# Altium project ADCS C2Sv1_2026-05-10T05_36_22_UTC.PrjPcb
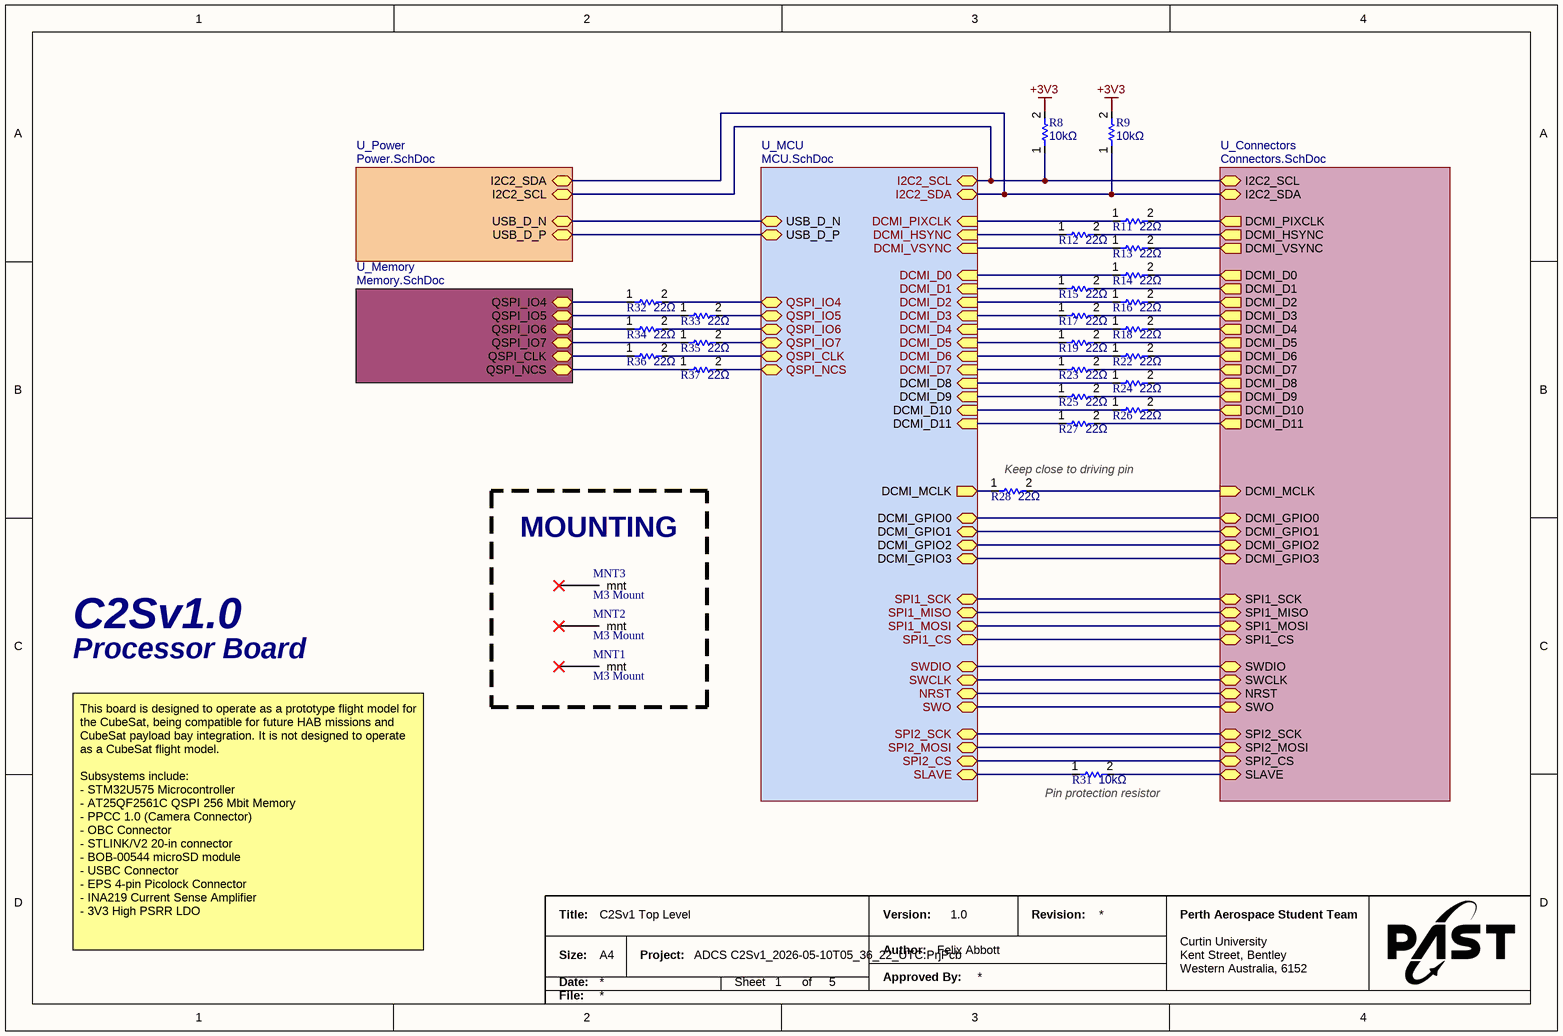
[diagram p0: TopLevel.SchDoc]
Author: Felix Abbott; Version: 1.0
5 sheets, 81 parts. Net scope: hierarchical (ports join the sheet entries above them; power ports are global).
Board file: C2Sv1.PcbDoc
Sheets:
  TopLevel.SchDoc
    U_Connectors = Connectors.SchDoc
    U_Memory = Memory.SchDoc
    U_Power = Power.SchDoc
    U_MCU = MCU.SchDoc

## Sheet TopLevel.SchDoc: C2Sv1 Top Level
size A4; Author: Felix Abbott; SheetNumber: 1; SheetTotal: 5; Time: CubeSat Camera System

### Parts
MNT1  M3 Mount  [M3_Mount-Footprint-1]
MNT2  M3 Mount  [M3_Mount-Footprint-1]
MNT3  M3 Mount  [M3_Mount-Footprint-1]
R8  value 10kΩ  [FP-CRCW0603-e3-IPC_C]  (hidden comment: CRCW060310K0FKED)
R9  value 10kΩ  [FP-CRCW0603-e3-IPC_C]  (hidden comment: CRCW060310K0FKED)
R11  value 22Ω  [FP-CRCW0402-e3-IPC_A]  (hidden comment: CRCW040222R0JNED)
R12  value 22Ω  [FP-CRCW0402-e3-IPC_A]  (hidden comment: CRCW040222R0JNED)
R13  value 22Ω  [FP-CRCW0402-e3-IPC_A]  (hidden comment: CRCW040222R0JNED)
R14  value 22Ω  [FP-CRCW0402-e3-IPC_A]  (hidden comment: CRCW040222R0JNED)
R15  value 22Ω  [FP-CRCW0402-e3-IPC_A]  (hidden comment: CRCW040222R0JNED)
R16  value 22Ω  [FP-CRCW0402-e3-IPC_A]  (hidden comment: CRCW040222R0JNED)
R17  value 22Ω  [FP-CRCW0402-e3-IPC_A]  (hidden comment: CRCW040222R0JNED)
R18  value 22Ω  [FP-CRCW0402-e3-IPC_A]  (hidden comment: CRCW040222R0JNED)
R19  value 22Ω  [FP-CRCW0402-e3-IPC_A]  (hidden comment: CRCW040222R0JNED)
R22  value 22Ω  [FP-CRCW0402-e3-IPC_A]  (hidden comment: CRCW040222R0JNED)
R23  value 22Ω  [FP-CRCW0402-e3-IPC_A]  (hidden comment: CRCW040222R0JNED)
R24  value 22Ω  [FP-CRCW0402-e3-IPC_A]  (hidden comment: CRCW040222R0JNED)
R25  value 22Ω  [FP-CRCW0402-e3-IPC_A]  (hidden comment: CRCW040222R0JNED)
R26  value 22Ω  [FP-CRCW0402-e3-IPC_A]  (hidden comment: CRCW040222R0JNED)
R27  value 22Ω  [FP-CRCW0402-e3-IPC_A]  (hidden comment: CRCW040222R0JNED)
R28  value 22Ω  [FP-CRCW0402-e3-IPC_A]  (hidden comment: CRCW040222R0JNED)
R31  value 10kΩ  [FP-CRCW0603-e3-IPC_C]  (hidden comment: CRCW060310K0FKED)
R32  value 22Ω  [FP-CRCW0402-e3-IPC_A]  (hidden comment: CRCW040222R0JNED)
R33  value 22Ω  [FP-CRCW0402-e3-IPC_A]  (hidden comment: CRCW040222R0JNED)
R34  value 22Ω  [FP-CRCW0402-e3-IPC_A]  (hidden comment: CRCW040222R0JNED)
R35  value 22Ω  [FP-CRCW0402-e3-IPC_A]  (hidden comment: CRCW040222R0JNED)
R36  value 22Ω  [FP-CRCW0402-e3-IPC_A]  (hidden comment: CRCW040222R0JNED)
R37  value 22Ω  [FP-CRCW0402-e3-IPC_A]  (hidden comment: CRCW040222R0JNED)

### Blocks framed on the sheet
MOUNTING: MNT1-MNT3

### Sub-sheets
U_Connectors = Connectors.SchDoc: DCMI_D7 (out), DCMI_D6 (out), DCMI_D5 (out), DCMI_D4 (out), DCMI_D3 (out), DCMI_D2 (out), DCMI_D0 (out), DCMI_D1 (out), DCMI_PIXCLK (out), DCMI_HSYNC (out), DCMI_VSYNC (out), DCMI_D8 (out), DCMI_D9 (out), DCMI_D10 (out), DCMI_D11 (out), DCMI_MCLK (in), DCMI_GPIO0 (bidir), DCMI_GPIO1 (bidir), DCMI_GPIO2 (bidir), DCMI_GPIO3 (bidir), SPI1_SCK (bidir), SPI1_MISO (bidir), SPI1_MOSI (bidir), SPI1_CS (bidir), SWDIO (bidir), SWCLK (bidir), NRST (bidir), SWO (bidir), SPI2_SCK (bidir), SPI2_MOSI (bidir), SPI2_CS (bidir), SLAVE (bidir), I2C2_SCL (bidir), I2C2_SDA (bidir)
U_MCU = MCU.SchDoc: DCMI_PIXCLK (in), DCMI_VSYNC (in), DCMI_HSYNC (in), DCMI_D7 (in), DCMI_D6 (in), DCMI_D5 (in), DCMI_D4 (in), DCMI_D3 (in), DCMI_D2 (in), DCMI_D1 (in), DCMI_D0 (in), DCMI_D8 (in), DCMI_D9 (in), DCMI_D11 (in), DCMI_D10 (in), DCMI_MCLK (out), DCMI_GPIO0 (bidir), DCMI_GPIO2 (bidir), DCMI_GPIO1 (bidir), DCMI_GPIO3 (bidir), NRST (bidir), SWO (bidir), SWCLK (bidir), SWDIO (bidir), SPI1_MOSI (bidir), SPI1_MISO (bidir), SPI1_CS (bidir), SLAVE (bidir), SPI1_SCK (bidir), SPI2_SCK (bidir), SPI2_CS (bidir), SPI2_MOSI (bidir), I2C2_SCL (bidir), I2C2_SDA (bidir), QSPI_IO7 (bidir), QSPI_IO6 (bidir), QSPI_IO5 (bidir), QSPI_IO4 (bidir), QSPI_CLK (bidir), QSPI_NCS (bidir), USB_D_N (bidir), USB_D_P (bidir)
U_Memory = Memory.SchDoc: QSPI_IO4 (bidir), QSPI_IO5 (bidir), QSPI_IO6 (bidir), QSPI_IO7 (bidir), QSPI_CLK (bidir), QSPI_NCS (bidir)
U_Power = Power.SchDoc: USB_D_N (bidir), USB_D_P (bidir), I2C2_SDA (bidir), I2C2_SCL (bidir)

### Nets
+3V3: R8.2 R9.2
DCMI_D0: R14.1 ; sheet U_MCU/DCMI_D0
DCMI_D1: R15.1 ; sheet U_MCU/DCMI_D1
DCMI_D2: R16.1 ; sheet U_MCU/DCMI_D2
DCMI_D3: R17.1 ; sheet U_MCU/DCMI_D3
DCMI_D4: R18.1 ; sheet U_MCU/DCMI_D4
DCMI_D5: R19.1 ; sheet U_MCU/DCMI_D5
DCMI_D6: R22.1 ; sheet U_MCU/DCMI_D6
DCMI_D7: R23.1 ; sheet U_MCU/DCMI_D7
DCMI_D8: R24.1 ; sheet U_MCU/DCMI_D8
DCMI_D9: R25.1 ; sheet U_MCU/DCMI_D9
DCMI_D10: R26.1 ; sheet U_MCU/DCMI_D10
DCMI_D11: R27.1 ; sheet U_MCU/DCMI_D11
DCMI_GPIO0: sheet U_Connectors/DCMI_GPIO0, sheet U_MCU/DCMI_GPIO0
DCMI_GPIO1: sheet U_Connectors/DCMI_GPIO1, sheet U_MCU/DCMI_GPIO1
DCMI_GPIO2: sheet U_Connectors/DCMI_GPIO2, sheet U_MCU/DCMI_GPIO2
DCMI_GPIO3: sheet U_Connectors/DCMI_GPIO3, sheet U_MCU/DCMI_GPIO3
DCMI_HSYNC: R12.1 ; sheet U_MCU/DCMI_HSYNC
DCMI_MCLK: R28.1 ; sheet U_MCU/DCMI_MCLK
DCMI_PIXCLK: R11.1 ; sheet U_MCU/DCMI_PIXCLK
DCMI_VSYNC: R13.1 ; sheet U_MCU/DCMI_VSYNC
I2C2_SCL: R8.1 ; sheet U_Connectors/I2C2_SCL, sheet U_Power/I2C2_SCL, sheet U_MCU/I2C2_SCL
I2C2_SDA: R9.1 ; sheet U_Connectors/I2C2_SDA, sheet U_Power/I2C2_SDA, sheet U_MCU/I2C2_SDA
NRST: sheet U_Connectors/NRST, sheet U_MCU/NRST
QSPI_CLK: R36.2 ; sheet U_MCU/QSPI_CLK
QSPI_IO4: R32.2 ; sheet U_MCU/QSPI_IO4
QSPI_IO5: R33.2 ; sheet U_MCU/QSPI_IO5
QSPI_IO6: R34.2 ; sheet U_MCU/QSPI_IO6
QSPI_IO7: R35.2 ; sheet U_MCU/QSPI_IO7
QSPI_NCS: R37.2 ; sheet U_MCU/QSPI_NCS
SLAVE: R31.1 ; sheet U_MCU/SLAVE
SPI1_CS: sheet U_Connectors/SPI1_CS, sheet U_MCU/SPI1_CS
SPI1_MISO: sheet U_Connectors/SPI1_MISO, sheet U_MCU/SPI1_MISO
SPI1_MOSI: sheet U_Connectors/SPI1_MOSI, sheet U_MCU/SPI1_MOSI
SPI1_SCK: sheet U_Connectors/SPI1_SCK, sheet U_MCU/SPI1_SCK
SPI2_CS: sheet U_Connectors/SPI2_CS, sheet U_MCU/SPI2_CS
SPI2_MOSI: sheet U_Connectors/SPI2_MOSI, sheet U_MCU/SPI2_MOSI
SPI2_SCK: sheet U_Connectors/SPI2_SCK, sheet U_MCU/SPI2_SCK
SWCLK: sheet U_Connectors/SWCLK, sheet U_MCU/SWCLK
SWDIO: sheet U_Connectors/SWDIO, sheet U_MCU/SWDIO
SWO: sheet U_Connectors/SWO, sheet U_MCU/SWO
USB_D_N: sheet U_Power/USB_D_N, sheet U_MCU/USB_D_N
USB_D_P: sheet U_Power/USB_D_P, sheet U_MCU/USB_D_P
NetJ5_4: R12.2 ; sheet U_Connectors/DCMI_HSYNC
NetJ5_5: R13.2 ; sheet U_Connectors/DCMI_VSYNC
NetJ5_6: R11.2 ; sheet U_Connectors/DCMI_PIXCLK
NetJ5_8: R28.2 ; sheet U_Connectors/DCMI_MCLK
NetJ5_10: R27.2 ; sheet U_Connectors/DCMI_D11
NetJ5_11: R26.2 ; sheet U_Connectors/DCMI_D10
NetJ5_12: R25.2 ; sheet U_Connectors/DCMI_D9
NetJ5_13: R24.2 ; sheet U_Connectors/DCMI_D8
NetJ5_14: R23.2 ; sheet U_Connectors/DCMI_D7
NetJ5_15: R22.2 ; sheet U_Connectors/DCMI_D6
NetJ5_16: R19.2 ; sheet U_Connectors/DCMI_D5
NetJ5_17: R18.2 ; sheet U_Connectors/DCMI_D4
NetJ5_18: R17.2 ; sheet U_Connectors/DCMI_D3
NetJ5_19: R16.2 ; sheet U_Connectors/DCMI_D2
NetJ5_20: R15.2 ; sheet U_Connectors/DCMI_D1
NetJ5_21: R14.2 ; sheet U_Connectors/DCMI_D0
NetP3_2: R31.2 ; sheet U_Connectors/SLAVE
NetQSPI_1: R37.1 ; sheet U_Memory/QSPI_NCS
NetQSPI_2: R33.1 ; sheet U_Memory/QSPI_IO5
NetQSPI_3: R34.1 ; sheet U_Memory/QSPI_IO6
NetQSPI_5: R32.1 ; sheet U_Memory/QSPI_IO4
NetQSPI_6: R36.1 ; sheet U_Memory/QSPI_CLK
NetQSPI_7: R35.1 ; sheet U_Memory/QSPI_IO7

Not connected (* = marked no-connect by the designer): MNT1 1(mnt)*; MNT2 1(mnt)*; MNT3 1(mnt)*

### Notes on the sheet
- (near R28) Keep close to driving pin
- C2Sv1.0
- Processor Board
- (near R31) Pin protection resistor
- This board is designed to operate as a prototype flight model for the CubeSat, being compatible for future HAB missions and CubeSat payload bay integration. It is not designed to operate as a CubeSat flight model.
  Subsystems include:
  - STM32U575 Microcontroller
  - AT25QF2561C QSPI 256 Mbit Memory
  - PPCC 1.0 (Camera Connector)
  - OBC Connector
  - STLINK/V2 20-in connector
  - BOB-00544 microSD module
  - USBC Connector
  - EPS 4-pin Picolock Connector
  - INA219 Current Sense Amplifier
  - 3V3 High PSRR LDO
- Title:
- Version:
- Revision:
- Perth Aerospace Student Team
- Size:
- Date:
- A4
- Project:
- Sheet
- of
- Author:
- Approved By:
- Curtin University
- Kent Street, Bentley
- Western Australia, 6152
- File:

### Library data of the parts
MNT1-MNT3 = CMP-002-00124-2: M3 mounting hole; Author: Raphael Ho
R8 R9 R31 = CMP-009-00205-3: Resistor; Temperature Coefficient: 100ppm/°C; Working Voltage: 75V; Power Dissipation: 100mW; Added By: Felix; Tolerance: 1%; Max Operating Temperature: 155°C; Width: 850µm; Composition: Thick Film; Mounting Technology: Surface Mount; Number of Terminations: 2; Height: 450µm; Number of Terminals: 2; RoHS: Compliant; Power Rating: 100mW; Harmonized Tariff Schedule (HTS) Code: 8533.21.00.30; Case/Package: 0603; Export Control Classification Number (ECCN) Code: EAR99; Introduction Date: 2003-05-01; REACH SVHC: Yes; Lead Free: Lead Free; Features: Automotive AEC-Q200; Min Operating Temperature: -55°C; Voltage Rating: 75V; Country of Origin: Israel, Taiwan; Lifecycle Status: Production; Max Power Dissipation: 100mW; Length: 1.55mm; Packaging: Tape & Reel (TR); China RoHS: Non-Compliant
R11-R19 R22-R28 R32-R37 = CMP-009-00208-3: Resistor; Max Power Dissipation: 63mW; Tolerance: 5%; Added By: Felix Abbott; Working Voltage: 50V; Temperature Coefficient: 200ppm/°C; Lifecycle Status: Production; Case/Package: 0402; RoHS: Compliant; Features: Automotive AEC-Q200; Width: 500µm; REACH SVHC: Yes; Schedule B: 8533210045, 8533210045; Lead Free: Lead Free; Min Operating Temperature: -55°C; Pins: 2; Number of Terminations: 2; Export Control Classification Number (ECCN) Code: EAR99; Introduction Date: 2005-03-24; Ratings: AEC-Q200; Length: 1mm; Military Standard: Not; Power Rating: 63mW; Weight: 652.039032µg; Height: 350µm; Mounting Technology: Surface Mount; Termination: SMD/SMT; Composition: Thick Film; China RoHS: Non-Compliant; Max Operating Temperature: 155°C; Depth: 500µm; Country of Origin: Israel, Taiwan; Voltage Rating (DC): 50V; Packaging: Cut Tape; Contact Plating: Tin; Case Code (Imperial): 0402; Voltage Rating: 50V; Number of Terminals: 2; Harmonized Tariff Schedule (HTS) Code: 8533.21.00.30

## Sheet Connectors.SchDoc: C2S Connectors
size A4; SheetNumber: 5; SheetTotal: 5
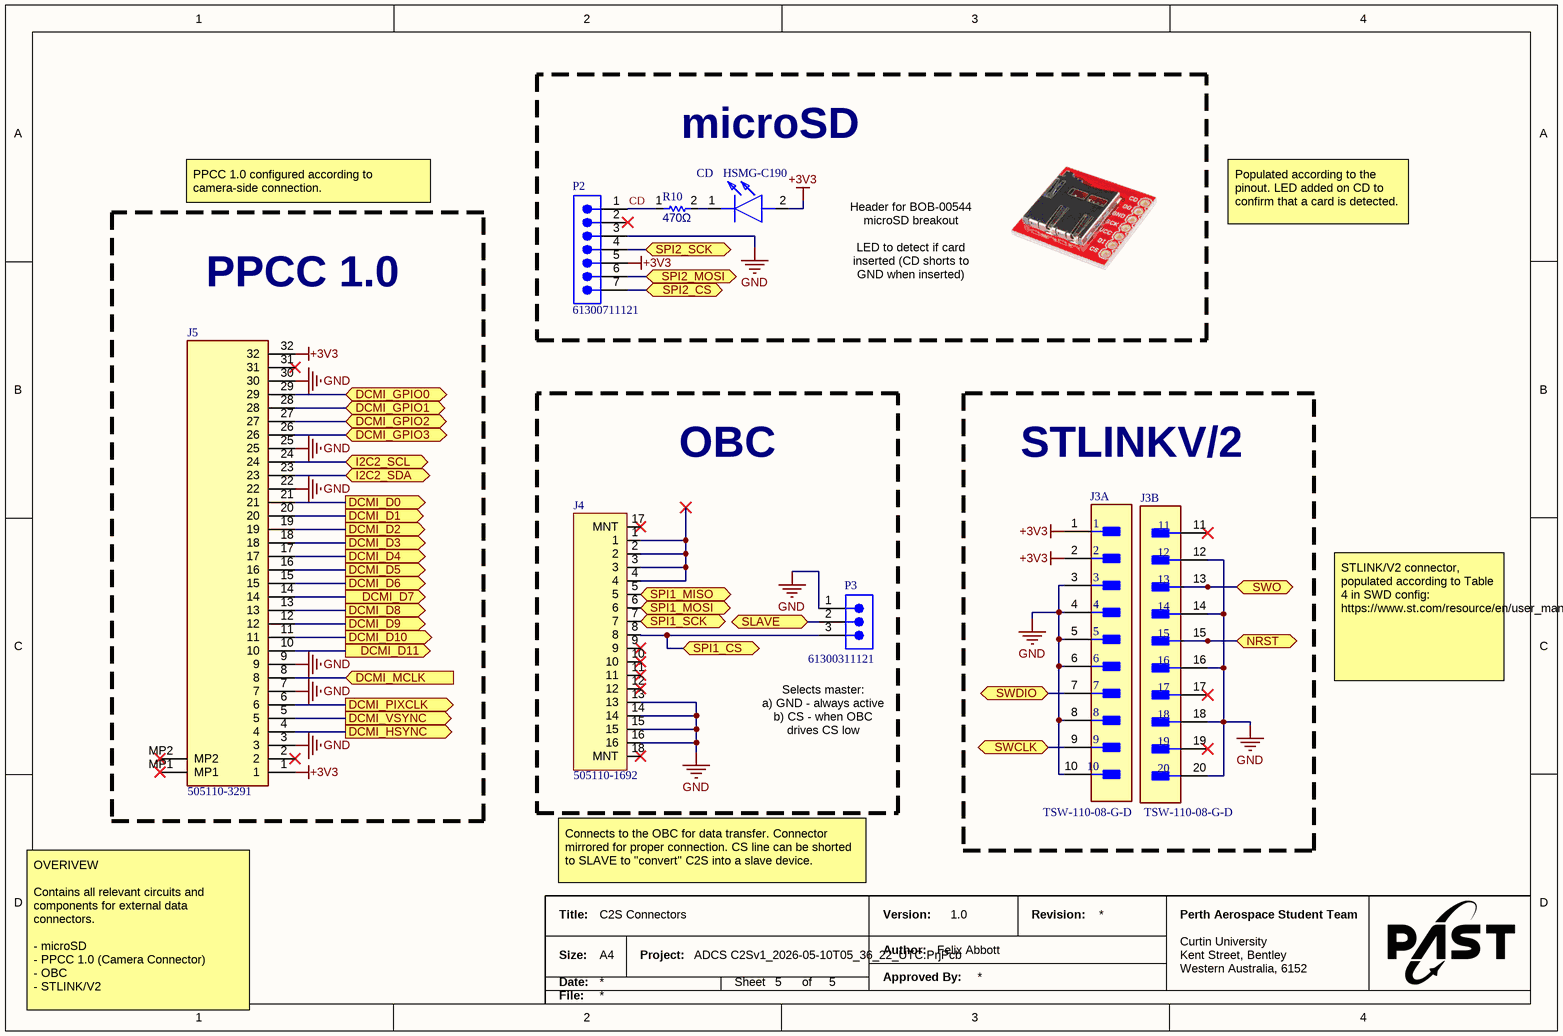
[diagram p1: Connectors.SchDoc]

### Parts
CD  HSMG-C190  [LEDC1608X90N]
J3  TSW-110-08-G-D  [FP-TSW-110-08-G-D-MFG]  (parts A,B of 2)
J4  505110-1692  [FP-505110-1692-MFG]
J5  505110-3291  [5051103291]
P2  61300711121  [61300711121]
P3  61300311121  [61300311121]
R10  value 470Ω  [FP-CRCW0603-e3-IPC_C]  (hidden comment: CRCW0603470RFKEC)

### Blocks framed on the sheet
microSD: CD P2 R10
PPCC 1.0: J5
OBC: J4 P3
STLINKV/2: J3

### Ports
DCMI_D0 (out), DCMI_D1 (out), DCMI_D2 (out), DCMI_D3 (out), DCMI_D4 (out), DCMI_D5 (out), DCMI_D6 (out), DCMI_D7 (out), DCMI_D8 (out), DCMI_D9 (out), DCMI_D10 (out), DCMI_D11 (out), DCMI_GPIO0 (bidir), DCMI_GPIO1 (bidir), DCMI_GPIO2 (bidir), DCMI_GPIO3 (bidir), DCMI_HSYNC (out), DCMI_MCLK (in), DCMI_PIXCLK (out), DCMI_VSYNC (out), I2C2_SCL (bidir), I2C2_SDA (bidir), NRST (bidir), SLAVE (bidir), SPI1_CS (bidir), SPI1_MISO (bidir), SPI1_MOSI (bidir), SPI1_SCK (bidir), SPI2_CS (bidir), SPI2_MOSI (bidir), SPI2_SCK (bidir), SWCLK (bidir), SWDIO (bidir), SWO (bidir)

### Nets
+3V3: CD.2(A) J3.1 J3.2 J5.1 J5.32 P2.5
GND: J3.3 J3.4 J3.5 J3.6 J3.8 J3.10 J3.12 J3.14 J3.16 J3.18 J3.20 J4.13 J4.14 J4.15 J4.16 J5.3 J5.7 J5.9 J5.22 J5.25 J5.30 P2.3 P3.1
CD: P2.1 R10.1
DCMI_GPIO0: J5.29 ; port DCMI_GPIO0
DCMI_GPIO1: J5.28 ; port DCMI_GPIO1
DCMI_GPIO2: J5.27 ; port DCMI_GPIO2
DCMI_GPIO3: J5.26 ; port DCMI_GPIO3
I2C2_SCL: J5.24 ; port I2C2_SCL
I2C2_SDA: J5.23 ; port I2C2_SDA
NRST: J3.15 ; port NRST
SPI1_CS: J4.8 P3.3 ; port SPI1_CS
SPI1_MISO: J4.5 ; port SPI1_MISO
SPI1_MOSI: J4.6 ; port SPI1_MOSI
SPI1_SCK: J4.7 ; port SPI1_SCK
SPI2_CS: P2.7 ; port SPI2_CS
SPI2_MOSI: P2.6 ; port SPI2_MOSI
SPI2_SCK: P2.4 ; port SPI2_SCK
SWCLK: J3.9 ; port SWCLK
SWDIO: J3.7 ; port SWDIO
SWO: J3.13 ; port SWO
NetCD_1: CD.1(K) R10.2
NetJ4_1: J4.1 J4.2 J4.3 J4.4
NetJ5_4: J5.4 ; port DCMI_HSYNC
NetJ5_5: J5.5 ; port DCMI_VSYNC
NetJ5_6: J5.6 ; port DCMI_PIXCLK
NetJ5_8: J5.8 ; port DCMI_MCLK
NetJ5_10: J5.10 ; port DCMI_D11
NetJ5_11: J5.11 ; port DCMI_D10
NetJ5_12: J5.12 ; port DCMI_D9
NetJ5_13: J5.13 ; port DCMI_D8
NetJ5_14: J5.14 ; port DCMI_D7
NetJ5_15: J5.15 ; port DCMI_D6
NetJ5_16: J5.16 ; port DCMI_D5
NetJ5_17: J5.17 ; port DCMI_D4
NetJ5_18: J5.18 ; port DCMI_D3
NetJ5_19: J5.19 ; port DCMI_D2
NetJ5_20: J5.20 ; port DCMI_D1
NetJ5_21: J5.21 ; port DCMI_D0
NetP3_2: P3.2 ; port SLAVE

Not connected (* = marked no-connect by the designer): J3 11* 17* 19*; J4 9* 10* 11* 12* 17(MNT)* 18(MNT)*; J5 2* 31* MP1* MP2*; P2 2*

### Notes on the sheet
- PPCC 1.0 configured according to camera-side connection.
- Populated according to the pinout. LED added on CD to confirm that a card is detected.
- Header for BOB-00544 microSD breakout
  LED to detect if card inserted (CD shorts to GND when inserted)
- STLINK/V2 connector, populated according to Table 4 in SWD config: https://www.st.com/resource/en/user_manual/um1075-stlinkv2-incircuit-debuggerprogrammer-for-stm8-and-stm32-stmicroelectronics.pdf
- (near P3) Selects master:
  a) GND - always active
  b) CS - when OBC drives CS low
- Connects to the OBC for data transfer. Connector mirrored for proper connection. CS line can be shorted to SLAVE to "convert" C2S into a slave device.
- OVERIVEW
  Contains all relevant circuits and components for external data connectors.
  - microSD
  - PPCC 1.0 (Camera Connector)
  - OBC
  - STLINK/V2
- Title:
- Version:
- Revision:
- Perth Aerospace Student Team
- Size:
- Date:
- A4
- Project:
- Sheet
- of
- Author:
- Approved By:
- Curtin University
- Kent Street, Bentley
- Western Australia, 6152
- File:

### Library data of the parts
CD = CMP-062-000014-1: LED; Manufacturer_Name: Avago Technologies; Mouser Part Number: 630-HSMG-C190; Manufacturer_Part_Number: HSMG-C190; Mouser Price/Stock: https://www.mouser.co.uk/ProductDetail/Broadcom-Avago/HSMG-C190?qs=YDL0qNrpDT605sxOaps8VQ%3D%3D; Datasheet Link: https://docs.broadcom.com/docs/AV02-0551EN; Source: SamacSys.SchLib; Design Item ID: HSMG-C190; Height: 0.9mm
J3 = CMP-02766-000083-1: CONN HEADER VERT 20POS 2.54MM; Manufacturer: Samtec; Conn Gender: Male; Number Of Contacts: 20; Conn Orientation: Straight; Lead Free: Yes; Category: Conn; Manufacturer Part Number: TSW-110-08-G-D; Temperature Range High: +125°C; Pitch: 2.54mm; Temperature: -55°C to +125°C; Automotive: No; Device Class L1: Connectors; ComponentLink2URL: http://suddendocs.samtec.com/prints/tsw-xxx-xx-xxx-x-xx-xxx-mkt.pdf; Temperature Range Low: -55°C; ComponentLink2Description: Datasheet; Height: 8.71mm; Number Of Rows: 2; Digikey Description: CONN HEADER VERT 20POS 2.54MM; Package: TSW-110-08-G-D; Device Class L3: unset; Contact Material: Gold,Nickel; Octopart: https://octopart.com/tsw-110-08-g-d-samtec-272555; Footprint Url: http://suddendocs.samtec.com/prints/tsw-xxx-xx-x-x-xx-xxx-footprint.pdf; RoHS: TRUE; Ipc Land Pattern Name: CAPAD1016W80L630D240; Device Class L2: Headers and Wire Housings
J4 = CMP-002-00119-1: Conn FFC/FPC Connector SKT 16 POS 0.5mm Solder RA SMD Easy-On™ T/R
J5 = CMP-220-000001-1: Easy-On FFC/FPC Connector; Manufacturer_Name: Molex; Added By: Felix Abbott; Mouser Part Number: 538-505110-3291; Height: 4.06mm; Source: Schlib1.SchLib; Manufacturer_Part_Number: 505110-3291; Mouser Price/Stock: https://www.mouser.co.uk/ProductDetail/Molex/505110-3291?qs=0lSvoLzn4L9xGyl4KYdheA%3D%3D; Design Item ID: 505110-3291; Datasheet Link: https://www.molex.com/pdm_docs/sd/5051103291_sd.pdf
P2 = CMP-096-000168-1: WR-PHD Pin Header, THT, Vertical, pitch 2.54mm, 1 Row, 7P; Manufacturer: Wurth Elektronik; Rated Current: 3A; Withstanding Voltage: 500V; Working Voltage: 250V; Contact Resistance: 20mOhm; Match Code: WR-PHD; Orientation: Vertical; Component Type: Standard; Source: WR-PHD.SchLib; ComponentLink1URL: https://www.we-online.com/redexpert/article/61300711121?ad; Mount: Through Hole; Category: Board-to-Board Connectors; Packaging: Bag; Operating Temperature Max: 105°C; Number of Pins: 7; Design Item ID: 61300711121; Operating Temperature Min: -40°C; Pin Count: 7; Pitch: 2.54mm; Number of Rows: 1; Gender: Pin Header; Manufacturer Part Number: 61300711121; ComponentLink1Description: Website Link; ComponentLink2URL: https://www.we-online.com/redexpert/spec/61300711121?ad; ComponentLink2Description: Datasheet Link
P3 = CMP-096-000137-1: WR-PHD Pin Header, THT, Vertical, pitch 2.54mm, 1 Row, 3P; Manufacturer: Wurth Elektronik; Contact Resistance: 20mOhm; Rated Current: 3A; Withstanding Voltage: 500V; Working Voltage: 250V; Operating Temperature Max: 105°C; Manufacturer Part Number: 61300311121; Match Code: WR-PHD; ComponentLink2Description: Datasheet Link; ComponentLink1Description: Website Link; Number of Pins: 3; Orientation: Vertical; Mount: Through Hole; Gender: Pin Header; Pin Count: 3; ComponentLink2URL: https://www.we-online.com/redexpert/spec/61300311121?ad; Pitch: 2.54mm; Packaging: Bag; Operating Temperature Min: -40°C; ComponentLink1URL: https://www.we-online.com/redexpert/article/61300311121?ad; Component Type: Standard; Design Item ID: 61300311121; Source: WR-PHD.SchLib; Category: Board-to-Board Connectors; Number of Rows: 1
R10 = CMP-009-00206-1: Resistor; Power Dissipation: 100mW; Voltage Rating: 75V; Tolerance: 1%; Added By: Felix; Temperature Coefficient: 100ppm/°C; China RoHS: Non-Compliant; Mounting Technology: Surface Mount; Export Control Classification Number (ECCN) Code: EAR99; Depth: 850µm; Number of Terminals: 2; REACH SVHC: Yes; Case/Package: 0603; Harmonized Tariff Schedule (HTS) Code: 8533.21.00.30; Lifecycle Status: Production; Max Operating Temperature: 155°C; Length: 1.55mm; Lead Free: Lead Free; Max Power Dissipation: 100mW; RoHS: Compliant; Height: 450µm; Min Operating Temperature: -55°C; Width: 850µm; Country of Origin: Israel, Taiwan; Composition: Thick Film; Military Standard: Not; Number of Terminations: 2; Features: Automotive AEC-Q200; Packaging: Tape & Reel (TR); Power Rating: 100mW; Introduction Date: 2005-02-16; Working Voltage: 75V

## Sheet Memory.SchDoc: QSPI
size A4; SheetNumber: 3; SheetTotal: 5; Time: C2S Memory
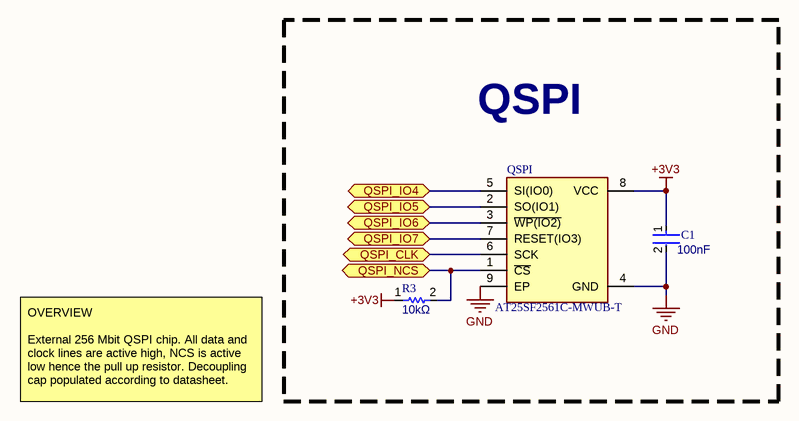
[diagram p2: Memory.SchDoc]

### Parts
C1  value 100nF  [FP-GCM188-0_1-IPC_B]  (hidden comment: GCM188L81H104MA57D)
QSPI  AT25SF2561C-MWUB-T  [SON127P800X600X80-9N-D]
R3  value 10kΩ  [FP-CRCW0603-e3-IPC_C]  (hidden comment: CRCW060310K0FKED)

### Blocks framed on the sheet
QSPI: C1 QSPI R3

### Ports
QSPI_CLK (bidir), QSPI_IO4 (bidir), QSPI_IO5 (bidir), QSPI_IO6 (bidir), QSPI_IO7 (bidir), QSPI_NCS (bidir)

### Nets
+3V3: C1.1 QSPI.8(VCC) R3.1
GND: C1.2 QSPI.4(GND) QSPI.9(EP)
NetQSPI_1: QSPI.1(~{CS}) R3.2 ; port QSPI_NCS
NetQSPI_2: QSPI.2(SO(IO1)) ; port QSPI_IO5
NetQSPI_3: QSPI.3(~{WP(IO2)}) ; port QSPI_IO6
NetQSPI_5: QSPI.5(SI(IO0)) ; port QSPI_IO4
NetQSPI_6: QSPI.6(SCK) ; port QSPI_CLK
NetQSPI_7: QSPI.7(RESET(IO3)) ; port QSPI_IO7

### Notes on the sheet
- OVERVIEW
  External 256 Mbit QSPI chip. All data and clock lines are active high, NCS is active low hence the pull up resistor. Decoupling cap populated according to datasheet.
- Title:
- Version:
- Revision:
- Perth Aerospace Student Team
- Size:
- Date:
- A4
- Project:
- Sheet
- of
- Author:
- Approved By:
- Curtin University
- Kent Street, Bentley
- Western Australia, 6152
- File:

### Library data of the parts
C1 = CMP-001-00108-1: Cap Ceramic 0.1uF 50V X8L 20% Pad SMD 0603 150C Automotive T/R; Manufacturer Lifecycle Status: IN PRODUCTION; Added By: Felix; Country of Origin: Philippines; Number of Terminals: 2; Max Operating Temperature: 150°C; Tolerance: 20%; Harmonized Tariff Schedule (HTS) Code: 8532.24.00.20; Length: 1.6mm; Thickness: 800µm; Export Control Classification Number (ECCN) Code: EAR99; Voltage Rating (DC): 50V; Mounting Technology: Surface Mount; Dielectric Material: Ceramic; Height: 800µm; Lifecycle Status: Production; Material: Ceramic; Introduction Date: 2013-11-20; Voltage Rating: 50V; Width: 800µm; RoHS: Compliant; REACH SVHC: Yes; Min Operating Temperature: -55°C; Case/Package: 0603
QSPI = CMP-181-000004-3: Integrated Circuit; Manufacturer_Name: Renesas Electronics; Imported By: Felix; Source: C2Sv0.1.SchLib; Manufacturer_Part_Number: AT25SF2561C-MWUB-T; Height: 0.8mm; Design Item ID: AT25SF2561C-MWUB-T; Datasheet Link: https://www.renesas.com/us/en/products/memory-logic/non-volatile-memory/spi-nor-flash/at25sf2561c-256mbit-3v-spi-serial-flash-memory-single-dual-quad-io-qpi-and-dtr-support
R3 = CMP-009-00205-3: as R8 on sheet TopLevel; Max Operating Temperature: 155°C; Width: 850µm; Composition: Thick Film; Mounting Technology: Surface Mount; Number of Terminations: 2; Height: 450µm; Number of Terminals: 2; RoHS: Compliant; Power Rating: 100mW; Harmonized Tariff Schedule (HTS) Code: 8533.21.00.30; Case/Package: 0603; Export Control Classification Number (ECCN) Code: EAR99; Introduction Date: 2003-05-01; REACH SVHC: Yes; Lead Free: Lead Free; Features: Automotive AEC-Q200; Min Operating Temperature: -55°C; Voltage Rating: 75V; Country of Origin: Israel, Taiwan; Lifecycle Status: Production; Max Power Dissipation: 100mW; Length: 1.55mm; Packaging: Tape & Reel (TR); China RoHS: Non-Compliant

## Sheet Power.SchDoc: C2Sv1 Power
size A4; SheetNumber: 4; SheetTotal: 5
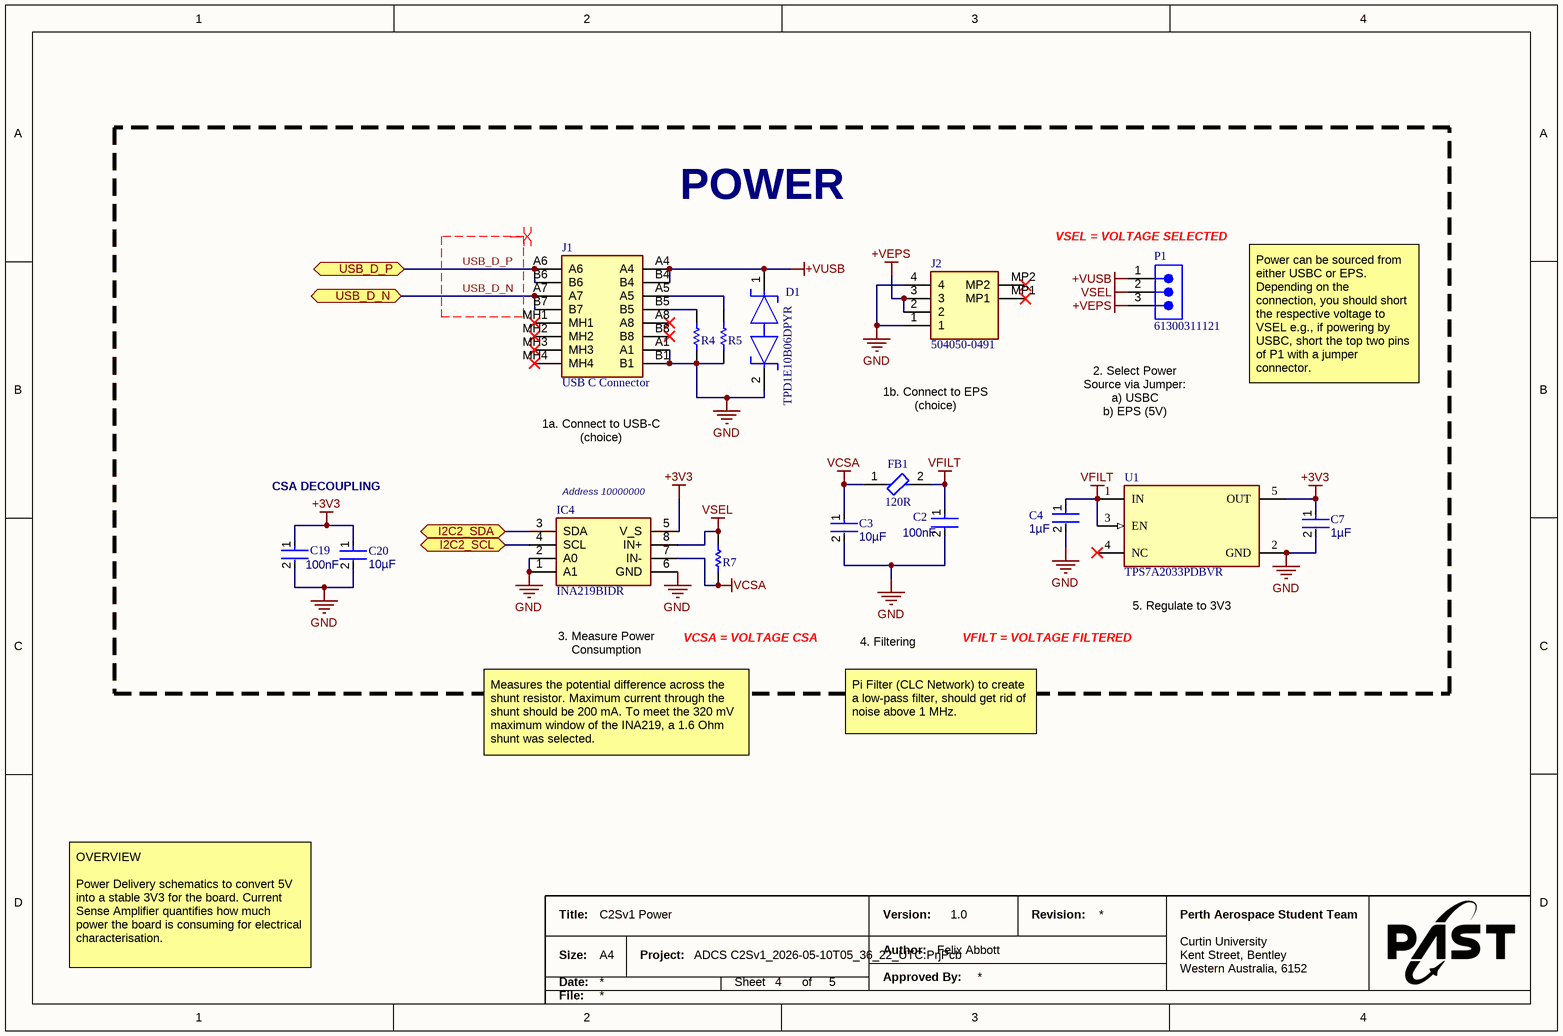
[diagram p3: Power.SchDoc]

### Parts
C2  value 100nF  [FP-GCM188-0_1-IPC_B]  (hidden comment: GCM188L81H104MA57D)
C3  value 10µF  [FP-GCM188-0_2-IPC_B]  (hidden comment: GCM188D70J106ME36D)
C4  value 1µF  [FP-GCM188-0_1-IPC_B]  (hidden comment: GCM188R71C105KA64J)
C7  value 1µF  [FP-GCM188-0_1-IPC_B]  (hidden comment: GCM188R71C105KA64J)
C19  value 100nF  [FP-GCM188-0_1-IPC_B]  (hidden comment: GCM188L81H104MA57D)
C20  value 10µF  [FP-GCM188-0_2-IPC_B]
D1  TPD1E10B06DPYR  [FP-DPY0002A-MFG]
FB1  120R  [FP-BLM18-0_15-t0_6-d1_2-IPC_B]
IC4  INA219BIDR  [SOIC127P600X175-8N]
J1  USB C Connector  [UJ20CHGMSMT2P16TR]
J2  504050-0491  [5040500491]
P1  61300311121  [61300311121]
R4  5.1k  [RESC1608X55N]  (value not drawn)
R5  5.1k  [RESC1608X55N]  (value not drawn)
R7  ERJ-6DQF1R6V  [ERJ6_B_BW_R_LW_CW_D]  (value not drawn)
U1  TPS7A2033PDBVR  [FP-DBV0005A-IPC_B]

### Ports
I2C2_SCL (bidir), I2C2_SDA (bidir), USB_D_N (bidir), USB_D_P (bidir)

### Nets
+3V3: C7.1 C19.1 C20.1 IC4.5(V_S) U1.5(OUT)
+VEPS: J2.2 J2.3 P1.3
+VUSB: D1.1 J1.A4 J1.B4 P1.1
GND: C2.2 C3.2 C4.2 C7.2 C19.2 C20.2 D1.2 IC4.1(A1) IC4.2(A0) IC4.6(GND) J1.A1 J1.B1 J2.1 J2.4 R4.2 R5.2 U1.2(GND)
VCSA: C3.1 FB1.1 IC4.7(IN-) R7.1
VFILT: C2.1 C4.1 FB1.2 U1.1(IN) U1.3(EN)
VSEL: IC4.8(IN+) P1.2 R7.2
I2C2_SCL: IC4.4(SCL) ; port I2C2_SCL
I2C2_SDA: IC4.3(SDA) ; port I2C2_SDA
USB_D_N: J1.A7 J1.B7 ; port USB_D_N
USB_D_P: J1.A6 J1.B6 ; port USB_D_P
NetJ1_A5: J1.A5 R5.1
NetJ1_B5: J1.B5 R4.1

Not connected (* = marked no-connect by the designer): J1 A8* B8* MH1* MH2* MH3* MH4*; J2 MP1* MP2*; U1 4(NC)*

### Layout directives
differential pair: USB_D_N, USB_D_P

### Notes on the sheet
- POWER
- (near P1) VSEL = VOLTAGE SELECTED
- Power can be sourced from either USBC or EPS. Depending on the connection, you should short the respective voltage to VSEL e.g., if powering by USBC, short the top two pins of P1 with a jumper connector.
- 1a. Connect to USB-C (choice)
- 1b. Connect to EPS (choice)
- 2. Select Power Source via Jumper:
  a) USBC
  b) EPS (5V)
- CSA DECOUPLING
- (near IC4) Address 10000000
- 3. Measure Power Consumption
- VCSA = VOLTAGE CSA
- 4. Filtering
- VFILT = VOLTAGE FILTERED
- (near U1) 5. Regulate to 3V3
- Measures the potential difference across the shunt resistor. Maximum current through the shunt should be 200 mA. To meet the 320 mV maximum window of the INA219, a 1.6 Ohm shunt was selected.
- Pi Filter (CLC Network) to create a low-pass filter, should get rid of noise above 1 MHz.
- OVERVIEW
  Power Delivery schematics to convert 5V into a stable 3V3 for the board. Current Sense Amplifier quantifies how much power the board is consuming for electrical characterisation.
- Title:
- Version:
- Revision:
- Perth Aerospace Student Team
- Size:
- Date:
- A4
- Project:
- Sheet
- of
- Author:
- Approved By:
- Curtin University
- Kent Street, Bentley
- Western Australia, 6152
- File:

### Library data of the parts
C2 C19 = CMP-001-00108-1: as C1 on sheet Memory; Country of Origin: Philippines; Number of Terminals: 2; Max Operating Temperature: 150°C; Tolerance: 20%; Harmonized Tariff Schedule (HTS) Code: 8532.24.00.20; Length: 1.6mm; Thickness: 800µm; Export Control Classification Number (ECCN) Code: EAR99; Voltage Rating (DC): 50V; Mounting Technology: Surface Mount; Dielectric Material: Ceramic; Height: 800µm; Lifecycle Status: Production; Material: Ceramic; Introduction Date: 2013-11-20; Voltage Rating: 50V; Width: 800µm; RoHS: Compliant; REACH SVHC: Yes; Min Operating Temperature: -55°C; Case/Package: 0603
C3 C20 = CMP-001-00109-1: 6.3V 10uF X7T ±20% 0603 Multilayer Ceramic Capacitors MLCC - SMD/SMT ROHS; Manufacturer Lifecycle Status: IN PRODUCTION; Added By: Felix; Thickness: 800µm; REACH SVHC: Yes; Voltage Rating (DC): 6.3V; Number of Terminals: 2; Dielectric Material: Ceramic; Lifecycle Status: Production; Harmonized Tariff Schedule (HTS) Code: 8532.24.00.20; Case/Package: 0603; Introduction Date: 2020-01-27; Schedule B: 8532240020; Mounting Technology: Surface Mount; Voltage Rating: 6.3V; Export Control Classification Number (ECCN) Code: EAR99; Min Operating Temperature: -55°C; RoHS: Compliant; Material: Ceramic; Width: 800µm; Max Operating Temperature: 125°C; Height: 800µm; Length: 1.6mm; Tolerance: 20%
C4 C7 = CMP-001-00107-1: 16V 1uF X7R ±10% 0603 Multilayer Ceramic Capacitors MLCC - SMD/SMT ROHS; Manufacturer Lifecycle Status: IN PRODUCTION; Added By: Felix; Tolerance: 10%; Max Operating Temperature: 125°C; Case Code (Imperial): 0603; Height: 800µm; Export Control Classification Number (ECCN) Code: EAR99; Voltage Rating (DC): 16V; Depth: 800µm; Case/Package: 0603; Case Code (Metric): 1608; Ratings: AEC-Q200; Mounting Technology: Surface Mount; Lifecycle Status: Production; RoHS: Compliant; Length: 1.6mm; Introduction Date: 2010-10-29; Radiation Hardening: No; Min Operating Temperature: -55°C; Packaging: Tape & Reel (TR); Lead Free: Lead Free; Voltage Rating: 16V; Material: Ceramic; Country of Origin: Philippines; Dielectric Material: Ceramic; REACH SVHC: Yes; Width: 800µm; Harmonized Tariff Schedule (HTS) Code: 8532.24.00.20; Number of Terminals: 2; Schedule B: 8532240020, 8532240020; Dielectric: X7R
D1 = CMP-0326-00004-4: TVS DIODE 5.5V 14V 2X1SON; Leakage Current: 100nA; Min Breakdown Voltage: 6V; Number of Channels: 1; ESD Protection: Yes; Power Line Protection: No; Test Current: 1mA; Interface: GPIO; Element Configuration: Single; Peak Pulse Current: 5A; Direction: Bidirectional; Peak Pulse Power: 90W; Capacitance: 12pF; Composition: Zener; Packaging: Tape and Reel; Number of Pins: 2; Breakdown Voltage: 6V; Radiation Hardening: No; Min Operating Temperature: -40°C; Contact Plating: Gold; Lead Free: Lead Free; Height: 0.35mm; REACH SVHC: No SVHC; Case/Package: 0402; Max Operating Temperature: 125°C; Width: 0.7mm; Clamping Voltage: 14V; Package Quantity: 1; Max Reverse Leakage Current: 100nA; Working Voltage: 5.5V; Length: 1.1mm; Number of Bidirectional Channels: 1; Reverse Standoff Voltage: 5.5V
FB1 = CMP-06046-002016-1: Chip Ferrite Bead Array, 0603, 120Ω @ 100MHz, 25%, 0.03Ω, 3A; DC Resistance (DCR): 30mR; Number of Lines: 1; Case/Package: 0603; Packaging: Tape and Reel; Case Code (Metric): 1608; Ratings: AEC-Q200; Max Operating Temperature: 125°C; Mount: Surface Mount; RoHS Compliant: Yes; Min Operating Temperature: -55°C; Max Current Rating: 3A; Case Code (Imperial): 0603
IC4 = CMP-033-000101-2: Integrated Circuit; Manufacturer_Name: Texas Instruments; Mouser Price/Stock: https://mou.sr/4bbpsfM; Design Item ID: INA219BIDR; Manufacturer_Part_Number: INA219BIDR; Datasheet Link: https://www.ti.com/lit/ds/symlink/ina219.pdf?HQS=TI-null-null-digikeymode-df-pf-null-wwe&ts=1601223553719; Author: Damon Stewart; Mouser Part Number: 595-INA219BIDR; Height: 1.75mm
J1 = CMP-026-000123-2: UJ20-C-H-G-MSMT-2-P16-TR Connector; Manufacturer_Name: Same Sky; Source: SamacSys.SchLib; Mouser Part Number: 179-UJ20CHGMSMT2P16T; Height: 3.36mm; Datasheet Link: https://cz.mouser.com/ProductDetail/Same-Sky/UJ20-C-H-G-MSMT-2-P16-TR?qs=IKkN%2F947nfBldcIwp9d6BA%3D%3D; Manufacturer_Part_Number: UJ20-C-H-G-MSMT-2-P16-TR; Mouser Price/Stock: https://www.mouser.co.uk/ProductDetail/Same-Sky/UJ20-C-H-G-MSMT-2-P16-TR?qs=IKkN%2F947nfBldcIwp9d6BA%3D%3D; Design Item ID: UJ20-C-H-G-MSMT-2-P16-TR; Author: Raphael Ho
J2 = CMP-026-000012-2: Connector; Manufacturer_Name: Molex; Manufacturer_Part_Number: 504050-0491; Design Item ID: 504050-0491; Mouser Price/Stock: https://www.mouser.co.uk/ProductDetail/Molex/504050-0491?qs=yXHQdf%252Bjwlut3yyE1%252ByhMA%3D%3D; Source: SamacSys.SchLib; Datasheet Link: http://www.molex.com/pdm_docs/sd/5040500491_sd.pdf; Mouser Part Number: 538-504050-0491; Height: 2.15mm
P1 = CMP-096-000137-1: as P3 on sheet Connectors; Operating Temperature Max: 105°C; Manufacturer Part Number: 61300311121; Match Code: WR-PHD; ComponentLink2Description: Datasheet Link; ComponentLink1Description: Website Link; Number of Pins: 3; Orientation: Vertical; Mount: Through Hole; Gender: Pin Header; Pin Count: 3; ComponentLink2URL: https://www.we-online.com/redexpert/spec/61300311121?ad; Pitch: 2.54mm; Packaging: Bag; Operating Temperature Min: -40°C; ComponentLink1URL: https://www.we-online.com/redexpert/article/61300311121?ad; Component Type: Standard; Design Item ID: 61300311121; Source: WR-PHD.SchLib; Category: Board-to-Board Connectors; Number of Rows: 1
R4 R5 = CMP-057-000007-2: AC0603FR-7W5K1L Resistor; Manufacturer_Name: YAGEO; Datasheet Link: https://www.yageo.com/upload/media/product/productsearch/datasheet/rchip/PYu-AC_51_RoHS_L_10.pdf; Height: 0.55mm; Design Item ID: AC0603FR-7W5K1L; Author: Raphael Ho; Manufacturer_Part_Number: AC0603FR-7W5K1L
R7 = CMP-238-000000-2: SMD Current Sense Resistor; Manufacturer_Name: Panasonic; Added By: Felix; Manufacturer_Part_Number: ERJ-6DQF1R6V; Mouser Price/Stock: https://www.mouser.com/Search/Refine.aspx?Keyword=667-ERJ-6DQF1R6V; Source: Schlib1.SchLib; Design Item ID: ERJ-6DQF1R6V; Mouser Part Number: 667-ERJ-6DQF1R6V; Datasheet Link: http://industrial.panasonic.com/cdbs/www-data/pdf/RDN0000/AOA0000C313.pdf
U1 = CMP-019-00056-1: 300mA ultra-low-noise low-IQ low-dropout (LDO) linear regulator with high PSRR 5-SOT-23 -40 to 125; Manufacturer Lifecycle Status: ACTIVE; Min Supply Voltage: 1.6V; Number of Outputs: 1; Added By: Felix Abbott; Output Voltage: 3.3V; Max Supply Voltage: 6V; Max Junction Temperature (Tj): 125°C; Dropout Voltage: 145mV; Nominal Supply Current: 6.5µA; Accuracy: 1.5%; Width: 1.6mm; Pins: 5; Height: 1.45mm; Thickness: 1.2mm; Max Operating Temperature: 125°C; RoHS: Compliant; Case/Package: SOT-23; Number of Channels: 1; Lifecycle Status: Production; Length: 2.9mm; Min Operating Temperature: -40°C; Output Current: 300mA

## Sheet MCU.SchDoc: C2Sv1 Schematic
size A4; Author: Felix Abbott; CompanyName: PAST; SheetNumber: 2; SheetTotal: 5
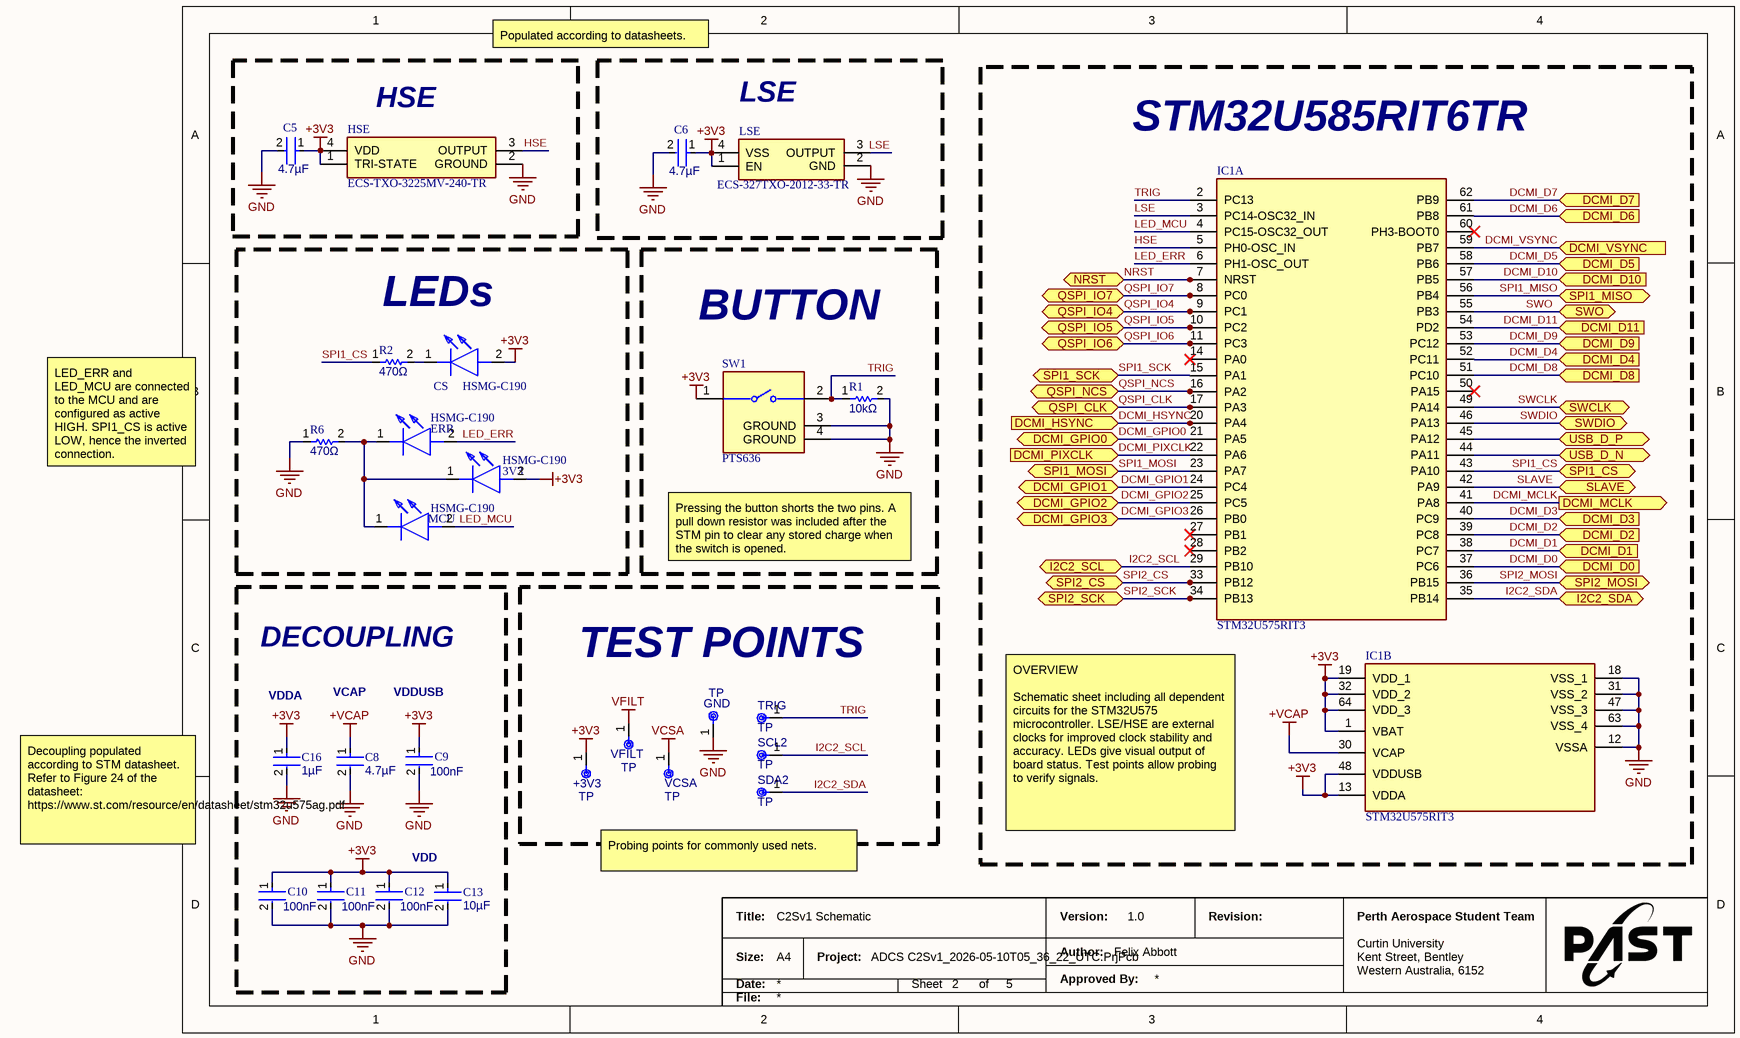
[diagram p4: MCU.SchDoc]

### Parts
3V3  HSMG-C190  [LEDC1608X90N]
+3V3  TP  [TP06R]  (no BOM)
C5  value 4.7µF  [FP-GRT188-0_2-IPC_B]  (hidden comment: GRT188C81E475KE13J)
C6  value 4.7µF  [FP-GRT188-0_2-IPC_B]  (hidden comment: GRT188C81E475KE13J)
C8  value 4.7µF  [FP-GRT188-0_2-IPC_B]  (hidden comment: GRT188C81E475KE13J)
C9  value 100nF  [FP-GCM188-0_1-IPC_B]  (hidden comment: GCM188L81H104MA57D)
C10  value 100nF  [FP-GCM188-0_1-IPC_B]  (hidden comment: GCM188L81H104MA57D)
C11  value 100nF  [FP-GCM188-0_1-IPC_B]  (hidden comment: GCM188L81H104MA57D)
C12  value 100nF  [FP-GCM188-0_1-IPC_B]  (hidden comment: GCM188L81H104MA57D)
C13  value 10µF  [FP-GCM188-0_2-IPC_B]  (hidden comment: GCM188D70J106ME36D)
C16  value 1µF  [FP-GCM188-0_1-IPC_B]  (hidden comment: GCM188R71C105KA64J)
CS  HSMG-C190  [LEDC1608X90N]
ERR  HSMG-C190  [LEDC1608X90N]
GND  TP  [TP06R]  (no BOM)
HSE  ECS-TXO-3225MV-240-TR  [ECSTXO3225MV240TR]
IC1  STM32U575RIT3  [QFP50P1200X1200X160-64N]  (parts A,B of 2)
LSE  ECS-327TXO-2012-33-TR  [ECS327TXO201233TR]
MCU  HSMG-C190  [LEDC1608X90N]
R1  value 10kΩ  [FP-CRCW0603-e3-IPC_C]  (hidden comment: CRCW060310K0FKED)
R2  value 470Ω  [FP-CRCW0603-e3-IPC_C]  (hidden comment: CRCW0603470RFKEC)
R6  value 470Ω  [FP-CRCW0603-e3-IPC_C]  (hidden comment: CRCW0603470RFKEC)
SCL2  TP  [TP06R]  (no BOM)
SDA2  TP  [TP06R]  (no BOM)
SW1  PTS636  [FP-PTS636_SKG25_SMTR_LFS-MFG]
TRIG  TP  [TP06R]  (no BOM)
VCSA  TP  [TP06R]  (no BOM)
VFILT  TP  [TP06R]  (no BOM)

### Blocks framed on the sheet
HSE: C5 HSE
LSE: C6 LSE
STM32U585RIT6TR: IC1
LEDs: 3V3 CS ERR MCU R2 R6
BUTTON: R1 SW1
DECOUPLING: C8-C13 C16
TEST POINTS: +3V3 GND SCL2 SDA2 TRIG VCSA VFILT

### Ports
DCMI_D0 (in), DCMI_D1 (in), DCMI_D2 (in), DCMI_D3 (in), DCMI_D4 (in), DCMI_D5 (in), DCMI_D6 (in), DCMI_D7 (in), DCMI_D8 (in), DCMI_D9 (in), DCMI_D10 (in), DCMI_D11 (in), DCMI_GPIO0 (bidir), DCMI_GPIO1 (bidir), DCMI_GPIO2 (bidir), DCMI_GPIO3 (bidir), DCMI_HSYNC (in), DCMI_MCLK (out), DCMI_PIXCLK (in), DCMI_VSYNC (in), I2C2_SCL (bidir), I2C2_SDA (bidir), NRST (bidir), QSPI_CLK (bidir), QSPI_IO4 (bidir), QSPI_IO5 (bidir), QSPI_IO6 (bidir), QSPI_IO7 (bidir), QSPI_NCS (bidir), SLAVE (bidir), SPI1_CS (bidir), SPI1_MISO (bidir), SPI1_MOSI (bidir), SPI1_SCK (bidir), SPI2_CS (bidir), SPI2_MOSI (bidir), SPI2_SCK (bidir), SWCLK (bidir), SWDIO (bidir), SWO (bidir), USB_D_N (bidir), USB_D_P (bidir)

### Nets
+3V3: 3V3.2(A) +3V3.1(TP) C5.1 C6.1 C9.1 C10.1 C11.1 C12.1 C13.1 C16.1 CS.2(A) HSE.1(TRI-STATE) HSE.4(VDD) IC1.1(VBAT) IC1.13(VDDA) IC1.19(VDD_1) IC1.32(VDD_2) IC1.48(VDDUSB) IC1.64(VDD_3) LSE.1(EN) LSE.4(VSS) SW1.1
+VCAP: C8.1 IC1.30(VCAP)
GND: C5.2 C6.2 C8.2 C9.2 C10.2 C11.2 C12.2 C13.2 C16.2 GND.1(TP) HSE.2(GROUND) IC1.12(VSSA) IC1.18(VSS_1) IC1.31(VSS_2) IC1.47(VSS_3) IC1.63(VSS_4) LSE.2(GND) R1.2 R6.1 SW1.3(GROUND) SW1.4(GROUND)
VCSA: VCSA.1(TP)
VFILT: VFILT.1(TP)
DCMI_D0: IC1.37(PC6) ; port DCMI_D0
DCMI_D1: IC1.38(PC7) ; port DCMI_D1
DCMI_D2: IC1.39(PC8) ; port DCMI_D2
DCMI_D3: IC1.40(PC9) ; port DCMI_D3
DCMI_D4: IC1.52(PC11) ; port DCMI_D4
DCMI_D5: IC1.58(PB6) ; port DCMI_D5
DCMI_D6: IC1.61(PB8) ; port DCMI_D6
DCMI_D7: IC1.62(PB9) ; port DCMI_D7
DCMI_D8: IC1.51(PC10) ; port DCMI_D8
DCMI_D9: IC1.53(PC12) ; port DCMI_D9
DCMI_D10: IC1.57(PB5) ; port DCMI_D10
DCMI_D11: IC1.54(PD2) ; port DCMI_D11
DCMI_GPIO0: IC1.21(PA5) ; port DCMI_GPIO0
DCMI_GPIO1: IC1.24(PC4) ; port DCMI_GPIO1
DCMI_GPIO2: IC1.25(PC5) ; port DCMI_GPIO2
DCMI_GPIO3: IC1.26(PB0) ; port DCMI_GPIO3
DCMI_HSYNC: IC1.20(PA4) ; port DCMI_HSYNC
DCMI_MCLK: IC1.41(PA8) ; port DCMI_MCLK
DCMI_PIXCLK: IC1.22(PA6) ; port DCMI_PIXCLK
DCMI_VSYNC: IC1.59(PB7) ; port DCMI_VSYNC
HSE: HSE.3(OUTPUT) IC1.5(PH0-OSC_IN)
I2C2_SCL: IC1.29(PB10) SCL2.1(TP) ; port I2C2_SCL
I2C2_SDA: IC1.35(PB14) SDA2.1(TP) ; port I2C2_SDA
LED_ERR: ERR.2(A) IC1.6(PH1-OSC_OUT)
LED_MCU: IC1.4(PC15-OSC32_OUT) MCU.2(A)
LSE: IC1.3(PC14-OSC32_IN) LSE.3(OUTPUT)
NRST: IC1.7(NRST) ; port NRST
QSPI_CLK: IC1.17(PA3) ; port QSPI_CLK
QSPI_IO4: IC1.9(PC1) ; port QSPI_IO4
QSPI_IO5: IC1.10(PC2) ; port QSPI_IO5
QSPI_IO6: IC1.11(PC3) ; port QSPI_IO6
QSPI_IO7: IC1.8(PC0) ; port QSPI_IO7
QSPI_NCS: IC1.16(PA2) ; port QSPI_NCS
SLAVE: IC1.42(PA9) ; port SLAVE
SPI1_CS: IC1.43(PA10) R2.1 ; port SPI1_CS
SPI1_MISO: IC1.56(PB4) ; port SPI1_MISO
SPI1_MOSI: IC1.23(PA7) ; port SPI1_MOSI
SPI1_SCK: IC1.15(PA1) ; port SPI1_SCK
SPI2_CS: IC1.33(PB12) ; port SPI2_CS
SPI2_MOSI: IC1.36(PB15) ; port SPI2_MOSI
SPI2_SCK: IC1.34(PB13) ; port SPI2_SCK
SWCLK: IC1.49(PA14) ; port SWCLK
SWDIO: IC1.46(PA13) ; port SWDIO
SWO: IC1.55(PB3) ; port SWO
TRIG: IC1.2(PC13) R1.1 SW1.2 TRIG.1(TP)
USB_D_N: IC1.44(PA11) ; port USB_D_N
USB_D_P: IC1.45(PA12) ; port USB_D_P
Net3V3_1: 3V3.1(K) ERR.1(K) MCU.1(K) R6.2
NetCS_1: CS.1(K) R2.2

Not connected (* = marked no-connect by the designer): IC1 14(PA0)* 27(PB1)* 28(PB2)* 50(PA15)* 60(PH3-BOOT0)*

### Notes on the sheet
- Populated according to datasheets.
- LED_ERR and LED_MCU are connected to the MCU and are configured as active HIGH. SPI1_CS is active LOW, hence the inverted connection.
- (near SW1) Pressing the button shorts the two pins. A pull down resistor was included after the STM pin to clear any stored charge when the switch is opened.
- VDDA
- VCAP
- VDDUSB
- Decoupling populated according to STM datasheet. Refer to Figure 24 of the datasheet: https://www.st.com/resource/en/datasheet/stm32u575ag.pdf
- VDD
- OVERVIEW
  Schematic sheet including all dependent circuits for the STM32U575 microcontroller. LSE/HSE are external clocks for improved clock stability and accuracy. LEDs give visual output of board status. Test points allow probing to verify signals.
- (near SDA2) Probing points for commonly used nets.
- Title:
- Version:
- Revision:
- Perth Aerospace Student Team
- Size:
- Date:
- A4
- Project:
- Sheet
- of
- Author:
- Approved By:
- Curtin University
- Kent Street, Bentley
- Western Australia, 6152
- File:

### Library data of the parts
3V3 CS ERR MCU = CMP-062-000014-1: as CD on sheet Connectors; Mouser Part Number: 630-HSMG-C190; Manufacturer_Part_Number: HSMG-C190; Mouser Price/Stock: https://www.mouser.co.uk/ProductDetail/Broadcom-Avago/HSMG-C190?qs=YDL0qNrpDT605sxOaps8VQ%3D%3D; Datasheet Link: https://docs.broadcom.com/docs/AV02-0551EN; Source: SamacSys.SchLib; Design Item ID: HSMG-C190; Height: 0.9mm
+3V3 GND SCL2 SDA2 TRIG VCSA VFILT = CMP-00028-00007-4: test point; Pins: 1; Author: Raphael Ho
C5 C6 C8 = CMP-001-00100-1: Ceramic Capacitor, Multilayer, Ceramic, 25V, 10% +Tol, 10% -Tol, X6S, 22% TC, 4.7uF, Surface Mount, 1608M/0603; Manufacturer Lifecycle Status: IN PRODUCTION; Added By: Felix; Width: 800µm; Material: Ceramic; Number of Terminals: 2; Introduction Date: 2016-01-27; Max Operating Temperature: 105°C; Export Control Classification Number (ECCN) Code: EAR99; Dielectric Material: Ceramic; REACH SVHC: Yes; Case/Package: 0603; Harmonized Tariff Schedule (HTS) Code: 8532.24.00.20; Min Operating Temperature: -55°C; Height: 800µm; RoHS: Compliant; Mounting Technology: Surface Mount; Voltage Rating: 25V; Thickness: 800µm; Tolerance: 10%; Lifecycle Status: Production; Voltage Rating (DC): 25V; Length: 1.6mm
C9-C12 = CMP-001-00108-1: as C1 on sheet Memory; Country of Origin: Philippines; Number of Terminals: 2; Max Operating Temperature: 150°C; Tolerance: 20%; Harmonized Tariff Schedule (HTS) Code: 8532.24.00.20; Length: 1.6mm; Thickness: 800µm; Export Control Classification Number (ECCN) Code: EAR99; Voltage Rating (DC): 50V; Mounting Technology: Surface Mount; Dielectric Material: Ceramic; Height: 800µm; Lifecycle Status: Production; Material: Ceramic; Introduction Date: 2013-11-20; Voltage Rating: 50V; Width: 800µm; RoHS: Compliant; REACH SVHC: Yes; Min Operating Temperature: -55°C; Case/Package: 0603
C13 = CMP-001-00109-1: as C3 on sheet Power; Thickness: 800µm; REACH SVHC: Yes; Voltage Rating (DC): 6.3V; Number of Terminals: 2; Dielectric Material: Ceramic; Lifecycle Status: Production; Harmonized Tariff Schedule (HTS) Code: 8532.24.00.20; Case/Package: 0603; Introduction Date: 2020-01-27; Schedule B: 8532240020; Mounting Technology: Surface Mount; Voltage Rating: 6.3V; Export Control Classification Number (ECCN) Code: EAR99; Min Operating Temperature: -55°C; RoHS: Compliant; Material: Ceramic; Width: 800µm; Max Operating Temperature: 125°C; Height: 800µm; Length: 1.6mm; Tolerance: 20%
C16 = CMP-001-00107-1: as C4 on sheet Power; Tolerance: 10%; Max Operating Temperature: 125°C; Case Code (Imperial): 0603; Height: 800µm; Export Control Classification Number (ECCN) Code: EAR99; Voltage Rating (DC): 16V; Depth: 800µm; Case/Package: 0603; Case Code (Metric): 1608; Ratings: AEC-Q200; Mounting Technology: Surface Mount; Lifecycle Status: Production; RoHS: Compliant; Length: 1.6mm; Introduction Date: 2010-10-29; Radiation Hardening: No; Min Operating Temperature: -55°C; Packaging: Tape & Reel (TR); Lead Free: Lead Free; Voltage Rating: 16V; Material: Ceramic; Country of Origin: Philippines; Dielectric Material: Ceramic; REACH SVHC: Yes; Width: 800µm; Harmonized Tariff Schedule (HTS) Code: 8532.24.00.20; Number of Terminals: 2; Schedule B: 8532240020, 8532240020; Dielectric: X7R
HSE = CMP-179-000000-2: Crystal or Oscillator; Manufacturer_Name: ECS; Source: C2Sv0.1.SchLib; Mouser Price/Stock: https://www.mouser.co.uk/ProductDetail/ECS/ECS-TXO-3225MV-240-TR?qs=d0WKAl%252BL4KYXn7UuwSFJGQ%3D%3D; Height: 1.2mm; Datasheet Link: https://eu.mouser.com/datasheet/2/122/ECS-TXO-3225MV-1634330.pdf; Mouser Part Number: 520-TXO-3225MV-240-T; Design Item ID: ECS-TXO-3225MV-240-TR; Manufacturer_Part_Number: ECS-TXO-3225MV-240-TR; Imported By: Felix
IC1 = CMP-209-000002-2: Ultra-low-power Arm Cortex-M33 32-bit MCU+TrustZone+FPU; Manufacturer_Name: STMicroelectronics; Added By: Felix Abbott; Manufacturer_Part_Number: STM32U575RIT3; Source: Schlib1.SchLib; Height: 1.6mm; Datasheet Link: https://www.st.com/resource/en/datasheet/stm32u575ag.pdf; Design Item ID: STM32U575RIT3
LSE = CMP-190-000000-2: Crystal or Oscillator; Manufacturer_Name: ECS; Added By: Felix; Mouser Price/Stock: https://www.mouser.co.uk/ProductDetail/ECS/ECS-327TXO-2012-33-TR?qs=amGC7iS6iy%252Bnhf6zW2Y7hQ%3D%3D; Height: 1.2mm; Datasheet Link: https://ecsxtal.com/store/pdf/ECS-327TXO-2012.pdf; Manufacturer_Part_Number: ECS-327TXO-2012-33-TR; Mouser Part Number: 520-327TXO-2012-33TR; Source: Schematic Library.SchLib; Design Item ID: ECS-327TXO-2012-33-TR
R1 = CMP-009-00205-3: as R8 on sheet TopLevel; Max Operating Temperature: 155°C; Width: 850µm; Composition: Thick Film; Mounting Technology: Surface Mount; Number of Terminations: 2; Height: 450µm; Number of Terminals: 2; RoHS: Compliant; Power Rating: 100mW; Harmonized Tariff Schedule (HTS) Code: 8533.21.00.30; Case/Package: 0603; Export Control Classification Number (ECCN) Code: EAR99; Introduction Date: 2003-05-01; REACH SVHC: Yes; Lead Free: Lead Free; Features: Automotive AEC-Q200; Min Operating Temperature: -55°C; Voltage Rating: 75V; Country of Origin: Israel, Taiwan; Lifecycle Status: Production; Max Power Dissipation: 100mW; Length: 1.55mm; Packaging: Tape & Reel (TR); China RoHS: Non-Compliant
R2 R6 = CMP-009-00206-1: as R10 on sheet Connectors; China RoHS: Non-Compliant; Mounting Technology: Surface Mount; Export Control Classification Number (ECCN) Code: EAR99; Depth: 850µm; Number of Terminals: 2; REACH SVHC: Yes; Case/Package: 0603; Harmonized Tariff Schedule (HTS) Code: 8533.21.00.30; Lifecycle Status: Production; Max Operating Temperature: 155°C; Length: 1.55mm; Lead Free: Lead Free; Max Power Dissipation: 100mW; RoHS: Compliant; Height: 450µm; Min Operating Temperature: -55°C; Width: 850µm; Country of Origin: Israel, Taiwan; Composition: Thick Film; Military Standard: Not; Number of Terminations: 2; Features: Automotive AEC-Q200; Packaging: Tape & Reel (TR); Power Rating: 100mW; Introduction Date: 2005-02-16; Working Voltage: 75V
SW1 = CMP-011-00018-1: Tactile Switch; Contact Resistance: 100mΩ; Throw Configuration: SPST; Max Voltage Rating (DC): 12V; Electrical Life: 100kcycles; Max Current Rating: 50mA; Added by: Felix A; Number of Positions: 1; Operating Force: 2.94N; Sealable: IP40; Insulation Resistance: 100MΩ; Color: White; Max Operating Temperature: 90°C; Min Operating Temperature: -40°C; RoHS: Compliant; Mouser Link: https://au.mouser.com/c/electromechanical/switches/tactile-switches/?illuminated=Non-Illuminated&mounting%20direction=Straight&mounting%20style=SMD%2FSMT&series=PTS636&switch%20function=OFF%20-%20%28ON%29&termination%20style=SMD%2FSMT&instock=y; Height: 1.9mm; Contact Current Rating: 50mA; Life (Cycles): 100kcycles; Voltage Rating (DC): 12V; Lifecycle Status: Production; Schedule B: 8536509065; Mounting Technology: Surface Mount; Length: 6.1mm; REACH SVHC: Yes

## Nets that join several sheets
+3V3: TopLevel (R8.2 R9.2), Connectors (6 pins), Memory (C1.1 QSPI.8 R3.1), Power (5 pins), MCU (22 pins)
GND: Connectors (23 pins), Memory (C1.2 QSPI.4 QSPI.9), Power (17 pins), MCU (21 pins)
VCSA: Power (C3.1 FB1.1 IC4.7 R7.1), MCU (VCSA.1)
VFILT: Power (5 pins), MCU (VFILT.1)
DCMI_D0: TopLevel (R14.1), MCU (IC1.37)
DCMI_D1: TopLevel (R15.1), MCU (IC1.38)
DCMI_D2: TopLevel (R16.1), MCU (IC1.39)
DCMI_D3: TopLevel (R17.1), MCU (IC1.40)
DCMI_D4: TopLevel (R18.1), MCU (IC1.52)
DCMI_D5: TopLevel (R19.1), MCU (IC1.58)
DCMI_D6: TopLevel (R22.1), MCU (IC1.61)
DCMI_D7: TopLevel (R23.1), MCU (IC1.62)
DCMI_D8: TopLevel (R24.1), MCU (IC1.51)
DCMI_D9: TopLevel (R25.1), MCU (IC1.53)
DCMI_D10: TopLevel (R26.1), MCU (IC1.57)
DCMI_D11: TopLevel (R27.1), MCU (IC1.54)
DCMI_GPIO0: Connectors (J5.29), MCU (IC1.21)
DCMI_GPIO1: Connectors (J5.28), MCU (IC1.24)
DCMI_GPIO2: Connectors (J5.27), MCU (IC1.25)
DCMI_GPIO3: Connectors (J5.26), MCU (IC1.26)
DCMI_HSYNC: TopLevel (R12.1), MCU (IC1.20)
DCMI_MCLK: TopLevel (R28.1), MCU (IC1.41)
DCMI_PIXCLK: TopLevel (R11.1), MCU (IC1.22)
DCMI_VSYNC: TopLevel (R13.1), MCU (IC1.59)
I2C2_SCL: TopLevel (R8.1), Connectors (J5.24), Power (IC4.4), MCU (IC1.29 SCL2.1)
I2C2_SDA: TopLevel (R9.1), Connectors (J5.23), Power (IC4.3), MCU (IC1.35 SDA2.1)
NetJ5_4: TopLevel (R12.2), Connectors (J5.4)
NetJ5_5: TopLevel (R13.2), Connectors (J5.5)
NetJ5_6: TopLevel (R11.2), Connectors (J5.6)
NetJ5_8: TopLevel (R28.2), Connectors (J5.8)
NetJ5_10: TopLevel (R27.2), Connectors (J5.10)
NetJ5_11: TopLevel (R26.2), Connectors (J5.11)
NetJ5_12: TopLevel (R25.2), Connectors (J5.12)
NetJ5_13: TopLevel (R24.2), Connectors (J5.13)
NetJ5_14: TopLevel (R23.2), Connectors (J5.14)
NetJ5_15: TopLevel (R22.2), Connectors (J5.15)
NetJ5_16: TopLevel (R19.2), Connectors (J5.16)
NetJ5_17: TopLevel (R18.2), Connectors (J5.17)
NetJ5_18: TopLevel (R17.2), Connectors (J5.18)
NetJ5_19: TopLevel (R16.2), Connectors (J5.19)
NetJ5_20: TopLevel (R15.2), Connectors (J5.20)
NetJ5_21: TopLevel (R14.2), Connectors (J5.21)
NetP3_2: TopLevel (R31.2), Connectors (P3.2)
NetQSPI_1: TopLevel (R37.1), Memory (QSPI.1 R3.2)
NetQSPI_2: TopLevel (R33.1), Memory (QSPI.2)
NetQSPI_3: TopLevel (R34.1), Memory (QSPI.3)
NetQSPI_5: TopLevel (R32.1), Memory (QSPI.5)
NetQSPI_6: TopLevel (R36.1), Memory (QSPI.6)
NetQSPI_7: TopLevel (R35.1), Memory (QSPI.7)
NRST: Connectors (J3.15), MCU (IC1.7)
QSPI_CLK: TopLevel (R36.2), MCU (IC1.17)
QSPI_IO4: TopLevel (R32.2), MCU (IC1.9)
QSPI_IO5: TopLevel (R33.2), MCU (IC1.10)
QSPI_IO6: TopLevel (R34.2), MCU (IC1.11)
QSPI_IO7: TopLevel (R35.2), MCU (IC1.8)
QSPI_NCS: TopLevel (R37.2), MCU (IC1.16)
SLAVE: TopLevel (R31.1), MCU (IC1.42)
SPI1_CS: Connectors (J4.8 P3.3), MCU (IC1.43 R2.1)
SPI1_MISO: Connectors (J4.5), MCU (IC1.56)
SPI1_MOSI: Connectors (J4.6), MCU (IC1.23)
SPI1_SCK: Connectors (J4.7), MCU (IC1.15)
SPI2_CS: Connectors (P2.7), MCU (IC1.33)
SPI2_MOSI: Connectors (P2.6), MCU (IC1.36)
SPI2_SCK: Connectors (P2.4), MCU (IC1.34)
SWCLK: Connectors (J3.9), MCU (IC1.49)
SWDIO: Connectors (J3.7), MCU (IC1.46)
SWO: Connectors (J3.13), MCU (IC1.55)
USB_D_N: Power (J1.A7 J1.B7), MCU (IC1.44)
USB_D_P: Power (J1.A6 J1.B6), MCU (IC1.45)